# Altium schematic sheet OUT_HIGHPOWER.SchDoc
size A4
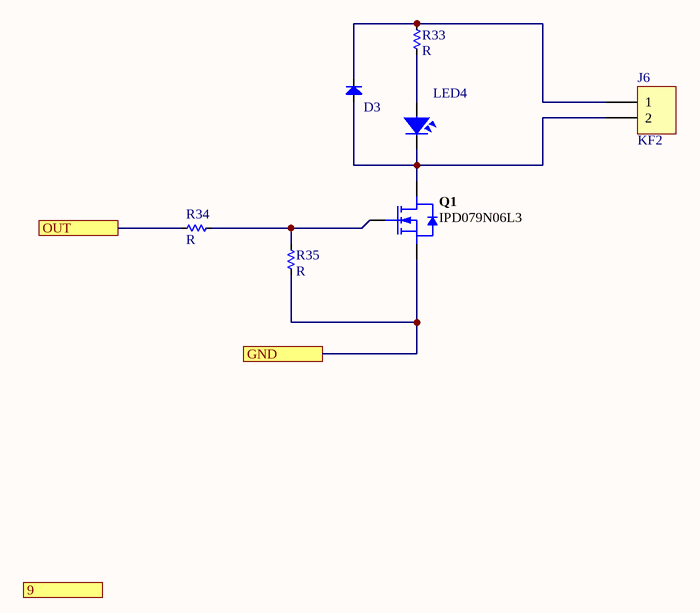
[diagram p0: OUT_HIGHPOWER.SchDoc]

## Parts
D3  Diode  [DIO-SMD-106-HayDung]  (value not drawn)
J6  KF2  [KF2-5.08T]
LED4  LED  [LED-0805-Blue]  (value not drawn)
Q1  IPD079N06L3  [TO252-3]
R33  R  [RES-SMD-0603_BIG]
R34  R  [RES-SMD-0603_BIG]
R35  R  [RES-SMD-0603_BIG]

## Ports
9, GND, OUT

## Nets
GND: Q1.3(S) R35.1 ; port GND
OUT: R34.1 ; port OUT
NetD3_1: D3.1(A) J6.2 LED4.2 Q1.2(D)
NetD3_2: D3.2(K) J6.1 R33.2
NetLED4_1: LED4.1 R33.1
NetQ1_1: Q1.1(G) R34.2 R35.2

## Library data of the parts
D3 = Diode: Default Diode; Code - JEDEC: DO-214-AB; Value: 1N5007; Published: 8-Jun-2000; Revision: July-2002: Re-released for DXP Platform.; Publisher: Altium Limited; ComponentLink1Description: ES1J - STMBL; ComponentLink1URL: https://banlinhkien.vn/goods-8089-es1j-do214-diode-1a-600v-sma-es1j-.html
J6 = KF2: Manufacturer: Würth Elektronik eiSos GmbH; partNo: 691103110002; ComponentLink1 Description: Manufacturer; ComponentLink2 Description: Datasheet; NoPins: 2; Created Date: 29 October 2013; ComponentLink1URL: http://www.we-online.com; ComponentLink2URL: http://katalog.we-online.de/em/datasheet/6911031100xx.pdf; Created by: Karrer Zheng
LED4 = LED SMD: Value: LED 3 - 5 ly 2 Colour
Q1 = FET_N: IPD079N06L3 - TO-252-3; Transistor Type: NPN; Mounting Technology: Surface Mount; Status: Unreleased; Category: Transistor-FET